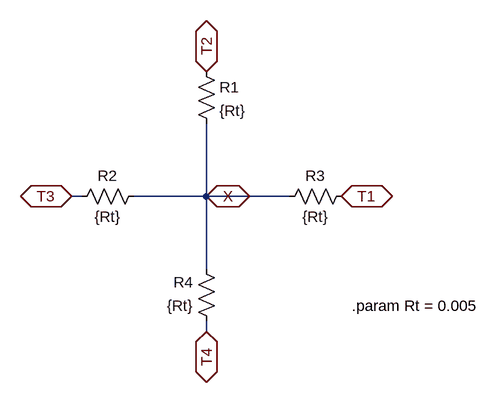
[diagram p0: schematic PV_Motif_Top_Plate.asc]
PV_Motif_Top_Plate.asc, the LTspice schematic file:
Version 4
SHEET 1 880 680
WIRE 0 176 -16 176
WIRE 192 176 192 64
WIRE 192 176 80 176
WIRE 320 176 192 176
WIRE 192 288 192 176
WIRE 192 384 192 368
FLAG 192 176 X
IOPIN 192 176 BiDir
FLAG 192 -16 T2
IOPIN 192 -16 BiDir
FLAG 400 176 T1
IOPIN 400 176 BiDir
FLAG 192 384 T4
IOPIN 192 384 BiDir
FLAG -16 176 T3
IOPIN -16 176 BiDir
SYMBOL res 176 -32 R0
SYMATTR InstName R1
SYMATTR Value {Rt}
SYMBOL res 96 160 R90
WINDOW 0 0 56 VBottom 2
WINDOW 3 32 56 VTop 2
SYMATTR InstName R2
SYMATTR Value {Rt}
SYMBOL res 416 160 R90
WINDOW 0 0 56 VBottom 2
WINDOW 3 32 56 VTop 2
SYMATTR InstName R3
SYMATTR Value {Rt}
SYMBOL res 208 384 R180
WINDOW 0 36 76 Left 2
WINDOW 3 36 40 Left 2
SYMATTR InstName R4
SYMATTR Value {Rt}
TEXT 416 344 Left 2 !.param Rt = 0.005

The netlist it stands for:
* PV_Motif_Top_Plate.asc
R1 T2 X {Rt}
R2 X T3 {Rt}
R3 T1 X {Rt}
R4 T4 X {Rt}
.param Rt = 0.005
.backanno
.end